# Altium schematic sheet TMS570LS1224 Microcontroller.SchDoc
size Letter
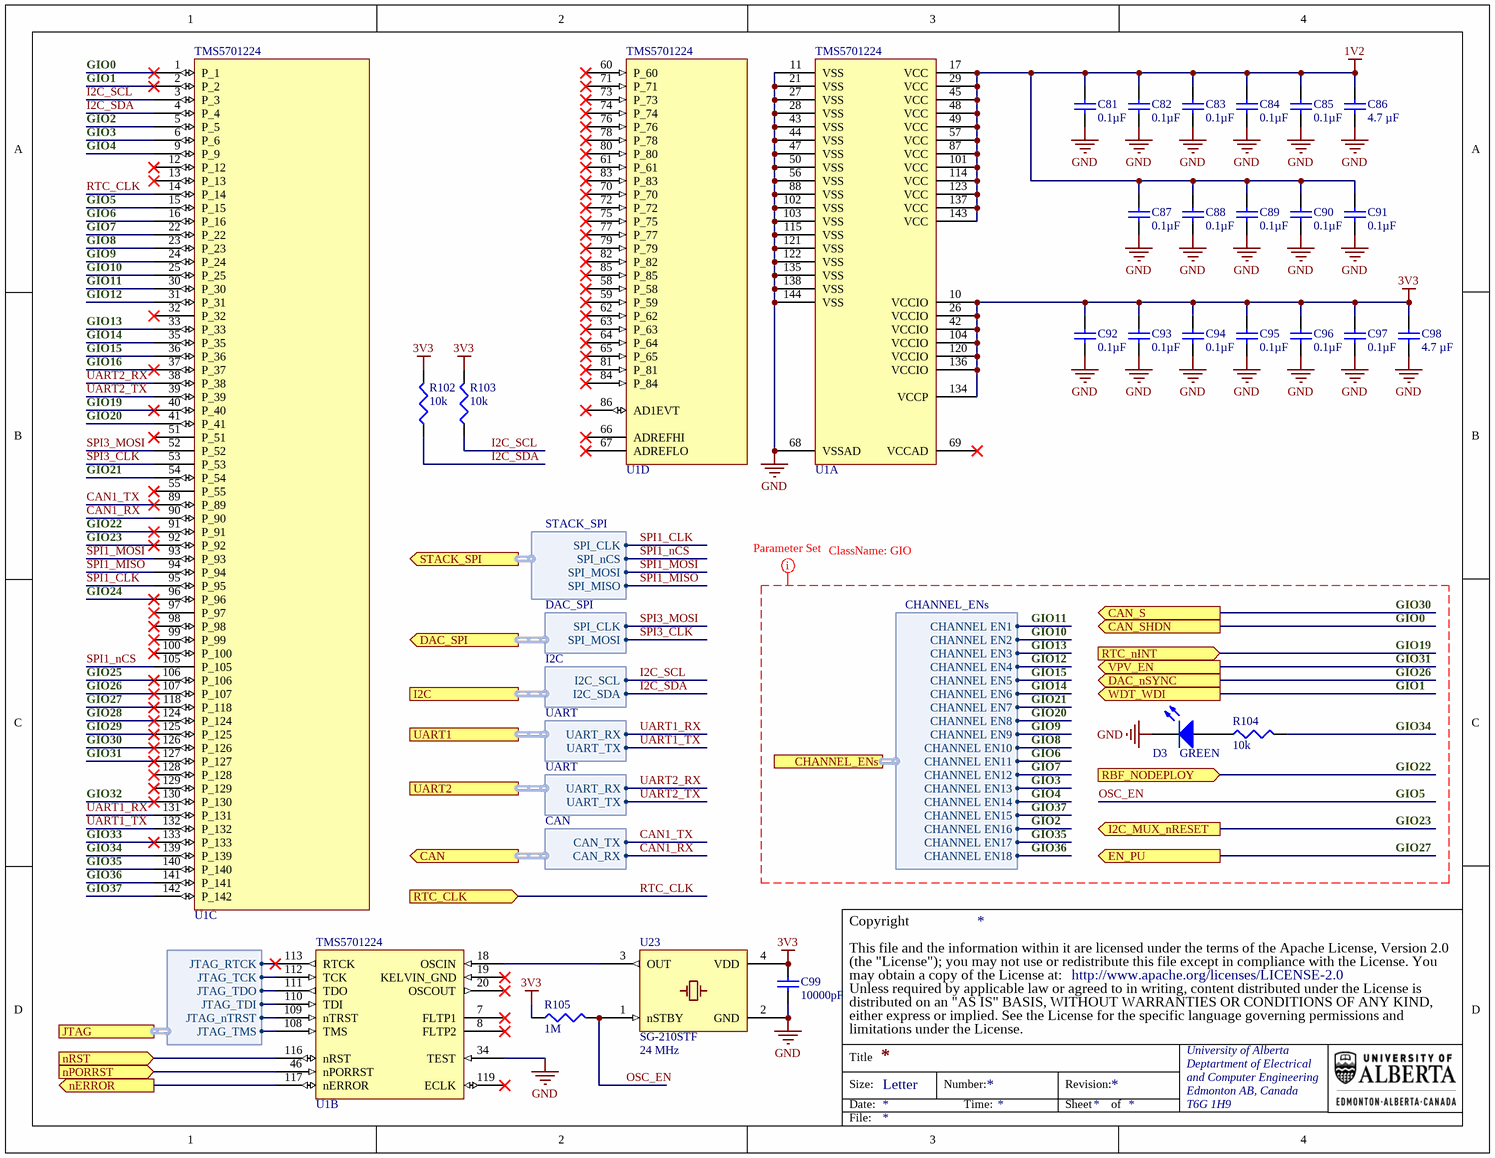
[diagram p0: TMS570LS1224 Microcontroller.SchDoc]

## Parts
C81  value 0.1µF  [TDK-CGA2B]  (hidden comment: Cap)
C82  value 0.1µF  [TDK-CGA2B]  (hidden comment: Cap)
C83  value 0.1µF  [TDK-CGA2B]  (hidden comment: Cap)
C84  value 0.1µF  [TDK-CGA2B]  (hidden comment: Cap)
C85  value 0.1µF  [TDK-CGA2B]  (hidden comment: Cap)
C86  value 4.7 µF  [MUR-GRM188]  (hidden comment: Cap)
C87  value 0.1µF  [TDK-CGA2B]  (hidden comment: Cap)
C88  value 0.1µF  [TDK-CGA2B]  (hidden comment: Cap)
C89  value 0.1µF  [TDK-CGA2B]  (hidden comment: Cap)
C90  value 0.1µF  [TDK-CGA2B]  (hidden comment: Cap)
C91  value 0.1µF  [TDK-CGA2B]  (hidden comment: Cap)
C92  value 0.1µF  [TDK-CGA2B]  (hidden comment: Cap)
C93  value 0.1µF  [TDK-CGA2B]  (hidden comment: Cap)
C94  value 0.1µF  [TDK-CGA2B]  (hidden comment: Cap)
C95  value 0.1µF  [TDK-CGA2B]  (hidden comment: Cap)
C96  value 0.1µF  [TDK-CGA2B]  (hidden comment: Cap)
C97  value 0.1µF  [TDK-CGA2B]  (hidden comment: Cap)
C98  value 4.7 µF  [MUR-GRM188]  (hidden comment: Cap)
C99  value 10000pF  [TDK-CGA2B]  (hidden comment: Cap)
D3  value GREEN  [WL-150060XS75000]  (hidden comment: LED)
R102  value 10k  [PANA-ERJ2R]  (hidden comment: Res3)
R103  value 10k  [PANA-ERJ2R]  (hidden comment: Res3)
R104  value 10k  [PANA-ERJ2R]  (hidden comment: Res3)
R105  value 1M  [PANA-ERJ2R]  (hidden comment: Res3)
U1  TMS5701224  [TI-S-PQFP-G144]  (parts A,B,C,D of 4)
U23  SG-210STF  value 24 MHz  [EPS-SG-210STF]

## Ports
CAN (out, harness CAN), CAN_S (out), CAN_SHDN (out), CHANNEL_ENs (harness CHANNEL_ENs), DAC_nSYNC (out), DAC_SPI (out, harness DAC_SPI), EN_PU (out), I2C (harness I2C), I2C_MUX_nRESET (out), JTAG (harness TMS570_JTAG), nERROR (out), nPORRST (in), nRST (in), RBF_NODEPLOY (in), RTC_CLK (in), RTC_nINT (in), STACK_SPI (out, harness STACK_SPI), UART1 (harness UART), UART2 (harness UART), VPV_EN (out), WDT_WDI (out)

## Harnesses
TMS570_JTAG: JTAG_TMS, JTAG_TCK, JTAG_TDO, JTAG_TDI, JTAG_nTRST, JTAG_RTCK
CHANNEL_ENs: CHANNEL EN1, CHANNEL EN2, CHANNEL EN3, CHANNEL EN4, CHANNEL EN5, CHANNEL EN6, CHANNEL EN7, CHANNEL EN8, CHANNEL EN9, CHANNEL EN10, CHANNEL EN11, CHANNEL EN12, CHANNEL EN13, CHANNEL EN14, CHANNEL EN15, CHANNEL EN16, CHANNEL EN17, CHANNEL EN18
I2C: I2C_SCL, I2C_SDA
UART: UART_TX, UART_RX
CAN: CAN_RX, CAN_TX
DAC_SPI: SPI_MOSI, SPI_CLK
STACK_SPI: SPI_MOSI, SPI_MISO, SPI_CLK, SPI_nCS

## Nets
1V2: C81.2 C82.2 C83.2 C84.2 C85.2 C86.2 C87.2 C88.2 C89.2 C90.2 C91.2 U1.17(VCC) U1.29(VCC) U1.45(VCC) U1.48(VCC) U1.49(VCC) U1.57(VCC) U1.87(VCC) U1.101(VCC) U1.114(VCC) U1.123(VCC) U1.137(VCC) U1.143(VCC)
3V3: C92.2 C93.2 C94.2 C95.2 C96.2 C97.2 C98.2 C99.2 R102.1 R103.1 R105.2 U1.10(VCCIO) U1.26(VCCIO) U1.42(VCCIO) U1.104(VCCIO) U1.120(VCCIO) U1.134(VCCP) U1.136(VCCIO) U23.4(VDD)
GND: C81.1 C82.1 C83.1 C84.1 C85.1 C86.1 C87.1 C88.1 C89.1 C90.1 C91.1 C92.1 C93.1 C94.1 C95.1 C96.1 C97.1 C98.1 C99.1 D3.2(K) U1.11(VSS) U1.21(VSS) U1.27(VSS) U1.28(VSS) U1.34(TEST) U1.43(VSS) U1.44(VSS) U1.47(VSS) U1.50(VSS) U1.56(VSS) U1.68(VSSAD) U1.88(VSS) U1.102(VSS) U1.103(VSS) U1.115(VSS) U1.121(VSS) U1.122(VSS) U1.135(VSS) U1.138(VSS) U1.144(VSS) U23.2(GND)
CAN1_RX: U1.90(P_90) ; port CAN.CAN_RX
CAN1_TX: U1.89(P_89) ; port CAN.CAN_TX
GIO0: U1.1(P_1) ; port CAN_SHDN
GIO1: U1.2(P_2) ; port WDT_WDI
GIO2: U1.5(P_5) ; port CHANNEL_ENs.CHANNEL EN16
GIO3: U1.6(P_6) ; port CHANNEL_ENs.CHANNEL EN13
GIO4: U1.9(P_9) ; port CHANNEL_ENs.CHANNEL EN14
GIO5: R105.1 U1.15(P_15) U23.1(nSTBY)  [also labelled OSC_EN]
GIO6: U1.16(P_16) ; port CHANNEL_ENs.CHANNEL EN11
GIO7: U1.22(P_22) ; port CHANNEL_ENs.CHANNEL EN12
GIO8: U1.23(P_23) ; port CHANNEL_ENs.CHANNEL EN10
GIO9: U1.24(P_24) ; port CHANNEL_ENs.CHANNEL EN9
GIO10: U1.25(P_25) ; port CHANNEL_ENs.CHANNEL EN2
GIO11: U1.30(P_30) ; port CHANNEL_ENs.CHANNEL EN1
GIO12: U1.31(P_31) ; port CHANNEL_ENs.CHANNEL EN4
GIO13: U1.33(P_33) ; port CHANNEL_ENs.CHANNEL EN3
GIO14: U1.35(P_35) ; port CHANNEL_ENs.CHANNEL EN6
GIO15: U1.36(P_36) ; port CHANNEL_ENs.CHANNEL EN5
GIO16: U1.37(P_37)
GIO19: U1.40(P_40) ; port RTC_nINT
GIO20: U1.41(P_41) ; port CHANNEL_ENs.CHANNEL EN8
GIO21: U1.54(P_54) ; port CHANNEL_ENs.CHANNEL EN7
GIO22: U1.91(P_91) ; port RBF_NODEPLOY
GIO23: U1.92(P_92) ; port I2C_MUX_nRESET
GIO24: U1.96(P_96)
GIO25: U1.106(P_106)
GIO26: U1.107(P_107) ; port DAC_nSYNC
GIO27: U1.118(P_118) ; port EN_PU
GIO28: U1.124(P_124)
GIO29: U1.125(P_125)
GIO30: U1.126(P_126) ; port CAN_S
GIO31: U1.127(P_127) ; port VPV_EN
GIO32: U1.130(P_130)
GIO33: U1.133(P_133)
GIO34: R104.1 U1.139(P_139)
GIO35: U1.140(P_140) ; port CHANNEL_ENs.CHANNEL EN17
GIO36: U1.141(P_141) ; port CHANNEL_ENs.CHANNEL EN18
GIO37: U1.142(P_142) ; port CHANNEL_ENs.CHANNEL EN15
I2C_SCL: R103.2 U1.3(P_3) ; port I2C.I2C_SCL
I2C_SDA: R102.2 U1.4(P_4) ; port I2C.I2C_SDA
nERROR: U1.117(nERROR) ; port nERROR
nPORRST: U1.46(nPORRST) ; port nPORRST
nRST: U1.116(nRST) ; port nRST
RTC_CLK: U1.14(P_14) ; port RTC_CLK
SPI1_CLK: U1.95(P_95) ; port STACK_SPI.SPI_CLK
SPI1_MISO: U1.94(P_94) ; port STACK_SPI.SPI_MISO
SPI1_MOSI: U1.93(P_93) ; port STACK_SPI.SPI_MOSI
SPI1_nCS: U1.105(P_105) ; port STACK_SPI.SPI_nCS
SPI3_CLK: U1.53(P_53) ; port DAC_SPI.SPI_MOSI
SPI3_MOSI: U1.52(P_52) ; port DAC_SPI.SPI_CLK
UART1_RX: U1.131(P_131) ; port UART1.UART_RX
UART1_TX: U1.132(P_132) ; port UART1.UART_TX
UART2_RX: U1.38(P_38) ; port UART2.UART_RX
UART2_TX: U1.39(P_39) ; port UART2.UART_TX
NetD3_1: D3.1(A) R104.2
NetU1_18: U1.18(OSCIN) U23.3(OUT)
NetU1_108: U1.108(TMS) ; port JTAG.JTAG_TMS
NetU1_109: U1.109(nTRST) ; port JTAG.JTAG_nTRST
NetU1_110: U1.110(TDI) ; port JTAG.JTAG_TDI
NetU1_111: U1.111(TDO) ; port JTAG.JTAG_TDO
NetU1_112: U1.112(TCK) ; port JTAG.JTAG_TCK
NetU1_113: U1.113(RTCK) ; port JTAG.JTAG_RTCK

Not connected (* = marked no-connect by the designer): U1 7(FLTP1)* 8(FLTP2)* 12(P_12)* 13(P_13)* 19(KELVIN_GND)* 20(OSCOUT)* 32(P_32)* 51(P_51)* 55(P_55)* 58(P_58)* 59(P_59)* 60(P_60)* 61(P_61)* 62(P_62)* 63(P_63)* 64(P_64)* 65(P_65)* 66(ADREFHI)* 67(ADREFLO)* 69(VCCAD)* 70(P_70)* 71(P_71)* 72(P_72)* 73(P_73)* 74(P_74)* 75(P_75)* 76(P_76)* 77(P_77)* 78(P_78)* 79(P_79)* 80(P_80)* 81(P_81)* 82(P_82)* 83(P_83)* 84(P_84)* 85(P_85)* 86(AD1EVT)* 97(P_97)* 98(P_98)* 99(P_99)* 100(P_100)* 119(ECLK)* 128(P_128)* 129(P_129)*

## Layout directives
net class GIO: GIO0, GIO1, GIO2, GIO3, GIO4, GIO5, GIO6, GIO7, GIO8, GIO9, GIO10, GIO11, GIO12, GIO13, GIO14, GIO15, GIO19, GIO20, GIO21, GIO22, GIO23, GIO26, GIO27, GIO30, GIO31, GIO34, GIO35, GIO36, GIO37, GND, OSC_EN

## Notes on the sheet
- (the "License"); you may not use or redistribute this file except in compliance with the License. You
- This file and the information within it are licensed under the terms of the Apache License, Version 2.0
- Copyright
- Unless required by applicable law or agreed to in writing, content distributed under the License is
- distributed on an "AS IS" BASIS, WITHOUT WARRANTIES OR CONDITIONS OF ANY KIND,
- either express or implied. See the License for the specific language governing permissions and
- limitations under the License.
- may obtain a copy of the License at:
- http://www.apache.org/licenses/LICENSE-2.0
- Title
- Size:
- Date:
- Letter
- Number:
- Time:
- Revision:
- Sheet
- of
- University of Alberta
- Deptartment of Electrical
- and Computer Engineering
- Edmonton AB, Canada
- T6G 1H9
- File:

## Library data of the parts
C81-C85 C87-C97 = PC-TDK-02259: CAP CER 0.1UF 50V X7R 0402; Manufacturer Part Number: CGA2B3X7R1H104K050BB; Index: 2259; Designator: C?; Tolerance: ±10%; Published: 2016-03-16; LatestRevisionDate: 2016-03-16; LatestRevisionNote: ...; PackageReference: 0402 (1005 Metric); Publisher: AlbertaSat; PackageDescription: Radial Cap, Thru-Hole; 2 Leads; 0.3 in Pin Spacing; Part Number: PC-TDK-02259; Supplier Part Number 1: 445-6899-1-ND; Supplier 1: Digi-key; Supplier Link: http://www.digikey.ca/product-search/en?keywords=445-6899-1-ND; Voltage - Rated: 50V; Temperature Coefficient: X7R; Applications: Automotive; Operating Temperature: -55°C ~ 125°C
C86 C98 = 10165: CAP CER 4.7UF 16V X7R 0603; Part Number: 10165; Manufacturer Part Number: GRM188Z71C475KE21D; Designator: C?; Tolerance: ±10%; Voltage - Rated: 25V; Published: 8-Jun-2000; LatestRevisionDate: 17-Jul-2002; LatestRevisionNote: Re-released for DXP Platform.; PackageReference: 0603 (1608 Metric); Publisher: Altium Limited; PackageDescription: Chip Capacitor, 2-Leads, Body 1.60x0.80mm, IPC Low Density; Supplier Part Number 1: 490-GRM188Z71C475KE21DCT-ND; Supplier 1: Digi-Key; Supplier Link: #https://www.digikey.ca/en/products/detail/murata-electronics/GRM188Z71C475KE21D/13401930#; Temperature Coefficient: X7R; Application: General Purpose; Operating Temperature: -55°C ~ 125°C; Supplier 2: Mouser; Supplier Part Number 2: 81-GRM188Z71C475KE1D
C99 = PC-TDK-01877: CAP CER 10000PF 50V X8R 0402; Manufacturer Part Number: CGA2B3X8R1H103K050BB; Index: 1877; Designator: C?; Tolerance: ±10%; Published: 2016-03-16; LatestRevisionDate: 2016-03-16; LatestRevisionNote: ...; PackageReference: 0402 (1005 Metric); Publisher: AlbertaSat; PackageDescription: Radial Cap, Thru-Hole; 2 Leads; 0.3 in Pin Spacing; Part Number: PC-TDK-01877; Supplier Part Number 1: 445-12303-1-ND; Supplier 1: Digi-key; Supplier Link: http://www.digikey.ca/product-search/en?keywords=445-12303-1-ND; Voltage - Rated: 50V; Temperature Coefficient: X8R; Applications: Automotive; Operating Temperature: -55°C ~ 150°C
D3 = 2: LED GREEN CLEAR 0603 SMD; Part Number: 2; Manufacturer Part Number: 150060GS75000; Designator: D?; Brightness: 430mcd; Published: 8-Jun-2000; LatestRevisionDate: 08-Jul-2005; LatestRevisionNote: Mech Layer 1 removed.; PackageReference: WL-150060XS75000; Publisher: Altium Limited; PackageDescription: LED; 2 Leads; Supplier Part Number 1: 732-4971-1-ND; Supplier 1: Digi-Key; Supplier Link: http://www.digikey.ca/product-search/en?keywords=732-4971-1-ND; Operating Temperature: -40°C ~ 85°C (TA)
R102-R104 = 17198: RES SMD 10K OHM 1% 1/10W 0402; Part Number: 17198; Manufacturer Part Number: ERJ-2RKF1002X; Designator: R?; Power: 0.1W, 1/10W; Temperature Coefficient: ±100ppm/°C; Published: 8-Jun-2000; LatestRevisionDate: 29-May-2009; LatestRevisionNote: IPC-7351 Footprint Added.; PackageReference: 0402 (1005 Metric); Publisher: Altium Limited; PackageDescription: Chip Resistor, 2-Leads, Body 1.00x0.50mm, IPC Low Density; Supplier Part Number 1: P10.0KLCT-ND; Supplier 1: Digi-Key; Supplier Link: http://www.digikey.ca/product-search/en?keywords=P10.0KLCT-ND; Tolerance: ±1%; Operating Temperature: -55°C ~ 155°C
R105 = 19704: RES SMD 1M OHM 1% 1/10W 0402; Part Number: 19704; Manufacturer Part Number: ERJ-2RKF1004X; Designator: R?; Power: 0.1W, 1/10W; Temperature Coefficient: ±100ppm/°C; Published: 8-Jun-2000; LatestRevisionDate: 29-May-2009; LatestRevisionNote: IPC-7351 Footprint Added.; PackageReference: 0402 (1005 Metric); Publisher: Altium Limited; PackageDescription: Chip Resistor, 2-Leads, Body 1.00x0.50mm, IPC Low Density; Supplier Part Number 1: P1.00MLCT-ND; Supplier 1: Digi-Key; Supplier Link: http://www.digikey.ca/product-search/en?keywords=P1.00MLCT-ND; Tolerance: ±1%; Operating Temperature: -55°C ~ 155°C
U1 = 59: IC MCU 32BIT 1.25MB FLASH 144QFP; Part Number: 59; Core Processor: Arm-Cortex - R4F; Core Size: 32-Bit; Speed: 160MHz; Program Memory Size: 1280KB (1280K x 8); RAM Size: 192K (192K X 8); Designator: U?; Supplier Part Number 2: 595-MS5701224CPGEQQ1; Supplier 2: Mouser; Manufacturer Part Number: TMS5701224CPGEQQ1; Supplier Part Number 1: 296-47200-ND; Supplier 1: Digi-Key; Supplier Link: #https://www.digikey.ca/product-detail/en/texas-instruments/TMS5701224CPGEQQ1/296-47200-ND/5414218#; PackageReference: 144-LQFP; Operating Temperature: -40°C ~ 125°C (TA)
U23 = PU-EPS-00002: XTAL OSC XO 24.0000MHZ CMOS SMD; Manufacturer Part Number: SG-210STF 24.0000MY0; Index: 2; Designator: U?; Frequency Stability: ±50ppm; Voltage - Supply: 1.6V ~ 3.63V; Current - Supply (Max): 2.2mA; Part Number: PU-EPS-00002; Supplier Part Number 1: 114-SG-210STF24.0000MY0CT-ND; Supplier 1: Digi-key; Supplier Part Number 2: 732-SG10STF240000MY0; Supplier 2: Mouser; Publisher: AlbertaSat; Published: 2023-05-04; LatestRevisionDate: 2023-05-04; LatestRevisionNote: ...; PackageReference: 4-SMD, No Lead; PackageDescription: DFN, 4-Leads, Body 2.00x2.50mm, Pitch 1.65mm, IPC Low Density; Supplier Link: #https://www.digikey.ca/en/products/detail/epson/SG-210STF-24-0000MY0/13645780?s=N4IgTCBcDaIMoHEC0YCMAGOAVAYgAjABYA6dM9AWQE10QBdAXyA#; Operating Temperature: -40°C ~ 105°C